# EAGLE design driver2 (EAGLE 9.5.2)
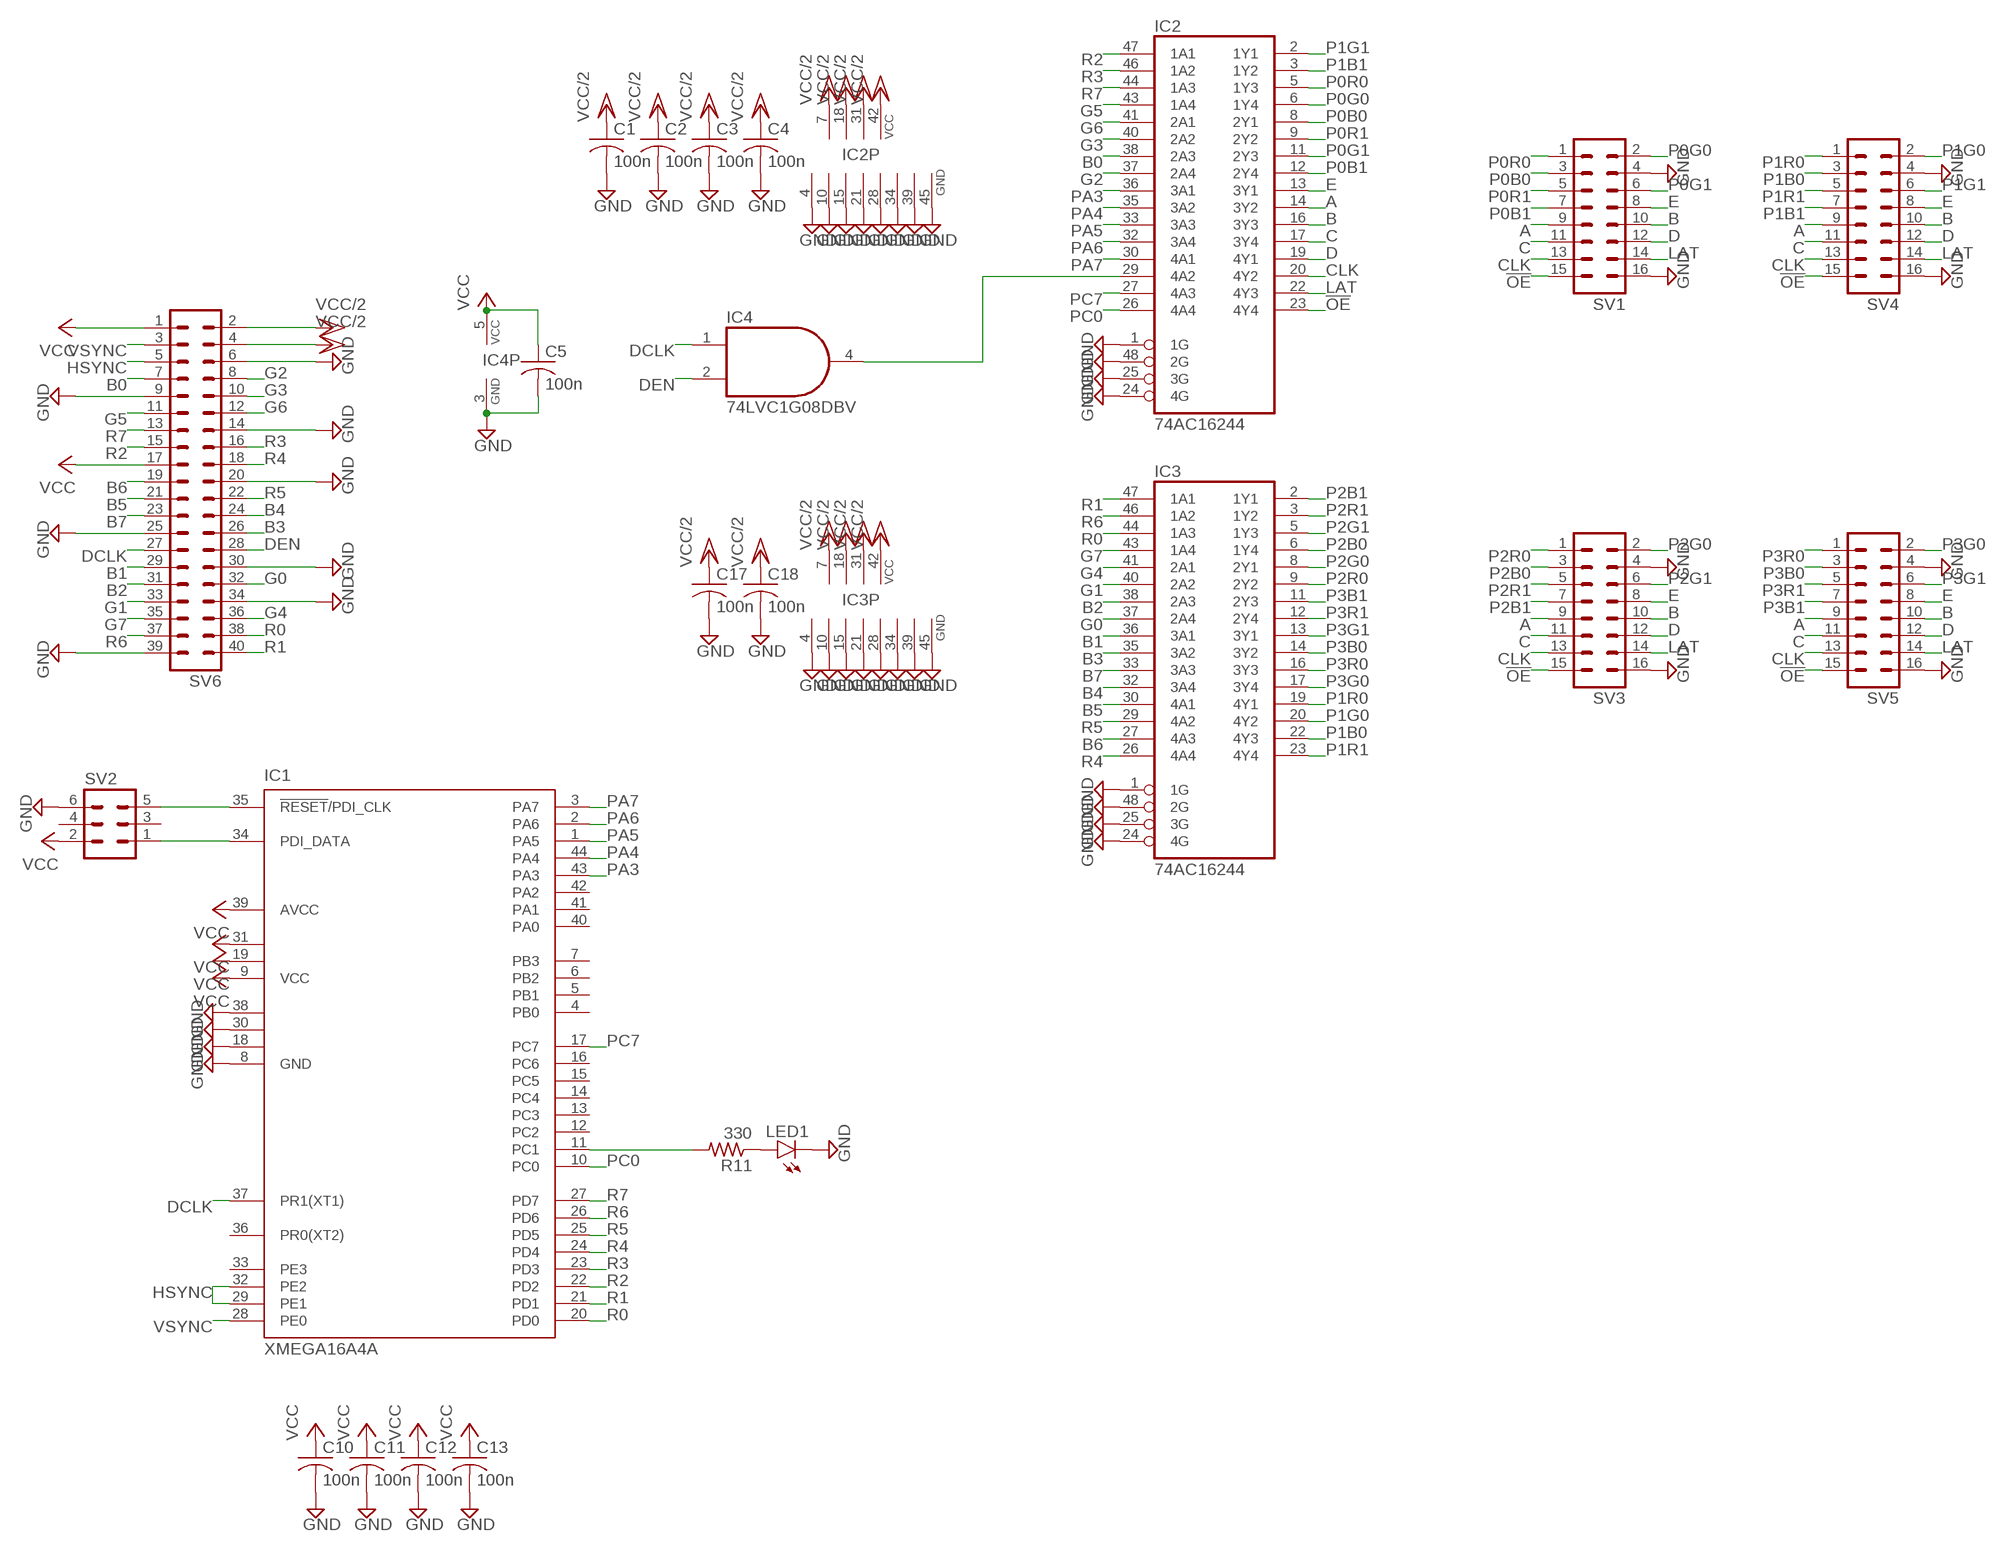
[diagram p0: schematic, sheet 1]

## Parts
C1  100n  C-USC0402  [C0402]
C2  100n  C-USC0402  [C0402]
C3  100n  C-USC0402  [C0402]
C4  100n  C-USC0402  [C0402]
C5  100n  C-USC0402  [C0402]
C10  100n  C-USC0402  [C0402]
C11  100n  C-USC0402  [C0402]
C12  100n  C-USC0402  [C0402]
C13  100n  C-USC0402  [C0402]
C17  100n  C-USC0402  [C0402]
C18  100n  C-USC0402  [C0402]
IC1  XMEGA16A4A  [TQFP44]
IC2  74AC16244  [SSOP48DL]
IC3  74AC16244  [SSOP48DL]
IC4  74LVC1G08DBV  [SOT23-5]
LED1  LEDCHIPLED_0805  [CHIPLED_0805]
R11  330  R-US_R0402  [R0402]
SV1  MA08-2  [MA08-2]
SV2  MA03-2  [MA03-2]
SV3  MA08-2  [MA08-2]
SV4  MA08-2  [MA08-2]
SV5  MA08-2  [MA08-2]
SV6  MA20-2  [MA20-2]

## Nets
!OE: IC2.23(4Y4) SV1.15 SV3.15 SV4.15 SV5.15
A: IC2.14(3Y2) SV1.9 SV3.9 SV4.9 SV5.9
B: IC2.16(3Y3) SV1.10 SV3.10 SV4.10 SV5.10
B0: IC2.38(2A3) SV6.7
B1: IC3.36(3A1) SV6.29
B2: IC3.38(2A3) SV6.31
B3: IC3.35(3A2) SV6.26
B4: IC3.32(3A4) SV6.24
B5: IC3.30(4A1) SV6.21
B6: IC3.27(4A3) SV6.19
B7: IC3.33(3A3) SV6.23
C: IC2.17(3Y4) SV1.11 SV3.11 SV4.11 SV5.11
CLK: IC2.20(4Y2) SV1.13 SV3.13 SV4.13 SV5.13
D: IC2.19(4Y1) SV1.12 SV3.12 SV4.12 SV5.12
DCLK: IC1.37(PR1(XT1)) IC4.1(I0) SV6.27
DEN: IC4.2(I1) SV6.28
E: IC2.13(3Y1) SV1.8 SV3.8 SV4.8 SV5.8
G0: IC3.37(2A4) SV6.32
G1: IC3.40(2A2) SV6.33
G2: IC2.37(2A4) SV6.8
G3: IC2.40(2A2) SV6.10
G4: IC3.41(2A1) SV6.36
G5: IC2.43(1A4) SV6.11
G6: IC2.41(2A1) SV6.12
G7: IC3.43(1A4) SV6.35
GND: C1.2 C2.2 C3.2 C4.2 C5.2 C10.2 C11.2 C12.2 C13.2 C17.2 C18.2 IC1.8(GND) IC1.18(GND1) IC1.30(GND2) IC1.38(GND3) IC2.1(1G) IC2.4(GND) IC2.10(GND) IC2.15(GND) IC2.21(GND) IC2.24(4G) IC2.25(3G) IC2.28(GND) IC2.34(GND) IC2.39(GND) IC2.45(GND) IC2.48(2G) IC3.1(1G) IC3.4(GND) IC3.10(GND) IC3.15(GND) IC3.21(GND) IC3.24(4G) IC3.25(3G) IC3.28(GND) IC3.34(GND) IC3.39(GND) IC3.45(GND) IC3.48(2G) IC4.3(GND) LED1.C SV1.4 SV1.16 SV2.6 SV3.4 SV3.16 SV4.4 SV4.16 SV5.4 SV5.16 SV6.6 SV6.9 SV6.14 SV6.20 SV6.25 SV6.30 SV6.34 SV6.39
HSYNC: IC1.29(PE1) IC1.32(PE2) SV6.5
LAT: IC2.22(4Y3) SV1.14 SV3.14 SV4.14 SV5.14
N$1: IC1.11(PC1) R11.2
N$16: IC2.29(4A2) IC4.4(O)
N$41: IC1.34(PDI_DATA) SV2.1
N$42: IC1.35(!RESET!/PDI_CLK) SV2.5
N$45: LED1.A R11.1
P0B0: IC2.8(2Y1) SV1.3
P0B1: IC2.12(2Y4) SV1.7
P0G0: IC2.6(1Y4) SV1.2
P0G1: IC2.11(2Y3) SV1.6
P0R0: IC2.5(1Y3) SV1.1
P0R1: IC2.9(2Y2) SV1.5
P1B0: IC3.22(4Y3) SV4.3
P1B1: IC2.3(1Y2) SV4.7
P1G0: IC3.20(4Y2) SV4.2
P1G1: IC2.2(1Y1) SV4.6
P1R0: IC3.19(4Y1) SV4.1
P1R1: IC3.23(4Y4) SV4.5
P2B0: IC3.6(1Y4) SV3.3
P2B1: IC3.2(1Y1) SV3.7
P2G0: IC3.8(2Y1) SV3.2
P2G1: IC3.5(1Y3) SV3.6
P2R0: IC3.9(2Y2) SV3.1
P2R1: IC3.3(1Y2) SV3.5
P3B0: IC3.14(3Y2) SV5.3
P3B1: IC3.11(2Y3) SV5.7
P3G0: IC3.17(3Y4) SV5.2
P3G1: IC3.13(3Y1) SV5.6
P3R0: IC3.16(3Y3) SV5.1
P3R1: IC3.12(2Y4) SV5.5
PA3: IC1.43(PA3) IC2.36(3A1)
PA4: IC1.44(PA4) IC2.35(3A2)
PA5: IC1.1(PA5) IC2.33(3A3)
PA6: IC1.2(PA6) IC2.32(3A4)
PA7: IC1.3(PA7) IC2.30(4A1)
PC0: IC1.10(PC0) IC2.26(4A4)
PC7: IC1.17(PC7) IC2.27(4A3)
R0: IC1.20(PD0) IC3.44(1A3) SV6.38
R1: IC1.21(PD1) IC3.47(1A1) SV6.40
R2: IC1.22(PD2) IC2.47(1A1) SV6.15
R3: IC1.23(PD3) IC2.46(1A2) SV6.16
R4: IC1.24(PD4) IC3.26(4A4) SV6.18
R5: IC1.25(PD5) IC3.29(4A2) SV6.22
R6: IC1.26(PD6) IC3.46(1A2) SV6.37
R7: IC1.27(PD7) IC2.44(1A3) SV6.13
VCC: C5.1 C10.1 C11.1 C12.1 C13.1 IC1.9(VCC) IC1.19(VCC1) IC1.31(VCC2) IC1.39(AVCC) IC4.5(VCC) SV2.2 SV6.1 SV6.17
VCC/2: C1.1 C2.1 C3.1 C4.1 C17.1 C18.1 IC2.7(VCC) IC2.18(VCC) IC2.31(VCC) IC2.42(VCC) IC3.7(VCC) IC3.18(VCC) IC3.31(VCC) IC3.42(VCC) SV6.2 SV6.4
VSYNC: IC1.28(PE0) SV6.3
Unconnected: IC1.4(PB0) IC1.5(PB1) IC1.6(PB2) IC1.7(PB3) IC1.12(PC2) IC1.13(PC3) IC1.14(PC4) IC1.15(PC5) IC1.16(PC6) IC1.33(PE3) IC1.36(PR0(XT2)) IC1.40(PA0) IC1.41(PA1) IC1.42(PA2) SV2.3 SV2.4

## Library data of the parts
C1-C5 C10-C13 C17 C18 = rcl:C-US: CAPACITOR, American symbol; SPICEPREFIX: C
IC1 = atmel:XMEGA16A4: MICROCONTROLLER Features High-performance, Low-power 8/16-bit AVR XMEGA Microcontroller Non-Volatile Program and Data Memories - 16 KB - 128 KB of In-System Self-Programmable Flash - 4 KB - 8 KB Boot Code Section with Independent Lock Bits - 1 KB - 2 KB EEPROM - 2 KB - 8 KB Internal SRAM Peripheral Features - Four-channel DMA Controller with support for external requests - Eight-channel Event System - Five 16-bit Timer/Counters Three Timer/Counters with 4 Output Compare or Input Capture channels Two Timer/Counters with 2 Output Compare or Input Capture channels High-Resolution Extensions on all Timer/Counters Advanced Waveform Extension on one Timer/Counter - Five USARTs IrDA Extension on one USART - Two Two-Wire Interfaces with dual address match (I2C and SMBus compatible) - Two SPIs (Serial Peripheral Interfaces) peripherals - AES and DES Crypto Engine - 16-bit Real Time Counter with Separate Oscillator - One Twelve-channel, 12-bit, 2 Msps Analog to Digital Converter - One Two-channel, 12-bit, 1 Msps Digital to Analog Converter - Two Analog Comparators with Window compare function - External Interrupts on all General Purpose I/O pins - Programmable Watchdog Timer with Separate On-chip Ultra Low Power Oscillator Special Microcontroller Features - Power-on Reset and Programmable Brown-out Detection - Internal and External Clock Options with PLL - Programmable Multi-level Interrupt Controller - Sleep Modes: Idle, Power-down, Standby, Power-save, Extended Standby - Advanced Programming, Test and Debugging Interfaces PDI (Program and Debug Interface) for programming, test and debugging I/O and Packages - 34 Programmable I/O Lines - 44 - lead TQFP - 44 - pad VQFN/QFN - 49 - ball VFBGA Operating Voltage - 1.6 - 3.6V Speed performance - 0 - 12 MHz @ 1.6 - 3.6V - 0 - 32 MHz @ 2.7 - 3.6V Drawn by Dipl.-Ing. (FH) Robert Siegler Created: 27.05.09; OC_FARNELL: unknown; OC_NEWARK: unknown
IC2 IC3 = 74ac-logic:74AC16244: 16-bit BUFFER/LINE DRIVER, 3-state
IC4 = 74xx-little-us:74*1G08: 2-input AND gate
LED1 = led:LED: LED OSRAM: - CHIPLED LG R971, LG N971, LY N971, LG Q971, LY Q971, LO R971, LY R971 LH N974, LH R974 LS Q976, LO Q976, LY Q976 LO Q996 - Hyper CHIPLED LW Q18S LB Q993, LB Q99A, LB R99A - SideLED LS A670, LO A670, LY A670, LG A670, LP A670 LB A673, LV A673, LT A673, LW A673 LH A674 LY A675 LS A676, LA A676, LO A676, LY A676, LW A676 LS A679, LY A679, LG A679 - Hyper Micro SIDELED® LS Y876, LA Y876, LO Y876, LY Y876 LT Y87S - SmartLED LW L88C, LW L88S LB L89C, LB L89S, LG L890 LS L89K, LO L89K, LY L89K LS L896, LA L896, LO L896, LY L896 - TOPLED LS T670, LO T670, LY T670, LG T670, LP T670 LSG T670, LSP T670, LSY T670, LOP T670, LYG T670 LG T671, LOG T671, LSG T671 LB T673, LV T673, LT T673, LW T673 LH T674 LS T676, LA T676, LO T676, LY T676, LB T676, LH T676, LSB T676, LW T676 LB T67C, LV T67C, LT T67C, LS T67K, LO T67K, LY T67K, LW E67C LS E67B, LA E67B, LO E67B, LY E67B, LB E67C, LV E67C, LT E67C LW T67C LS T679, LY T679, LG T679 LS T770, LO T770, LY T770, LG T770, LP T770 LB T773, LV T773, LT T773, LW T773 LH T774 LS E675, LA E675, LY E675, LS T675 LS T776, LA T776, LO T776, LY T776, LB T776 LHGB T686 LT T68C, LB T68C - Hyper Mini TOPLED® LB M676 - Mini TOPLED Santana® LG M470 LS M47K, LO M47K, LY M47K Source: http://www.osram.convergy.de LUXEON: - LUMILED® LXK2-PW12-R00, LXK2-PW12-S00, LXK2-PW14-U00, LXK2-PW14-V00 LXK2-PM12-R00, LXK2-PM12-S00, LXK2-PM14-U00 LXK2-PE12-Q00, LXK2-PE12-R00, LXK2-PE12-S00, LXK2-PE14-T00, LXK2-PE14-U00 LXK2-PB12-K00, LXK2-PB12-L00, LXK2-PB12-M00, LXK2-PB14-N00, LXK2-PB14-P00, LXK2-PB14-Q00 LXK2-PR12-L00, LXK2-PR12-M00, LXK2-PR14-Q00, LXK2-PR14-R00 LXK2-PD12-Q00, LXK2-PD12-R00, LXK2-PD12-S00 LXK2-PH12-R00, LXK2-PH12-S00 LXK2-PL12-P00, LXK2-PL12-Q00, LXK2-PL12-R00 Source: www.luxeon.com KINGBRIGHT: KA-3528ASYC Source: www.kingbright.com
R11 = rcl:R-US_: RESISTOR, American symbol; SPICEPREFIX: R
SV1 SV3-SV5 = con-lstb:MA08-2: PIN HEADER; OC_FARNELL: unknown; OC_NEWARK: unknown
SV2 = con-lstb:MA03-2: PIN HEADER; OC_FARNELL: unknown; OC_NEWARK: unknown
SV6 = con-lstb:MA20-2: PIN HEADER; OC_FARNELL: unknown; OC_NEWARK: unknown

## Board
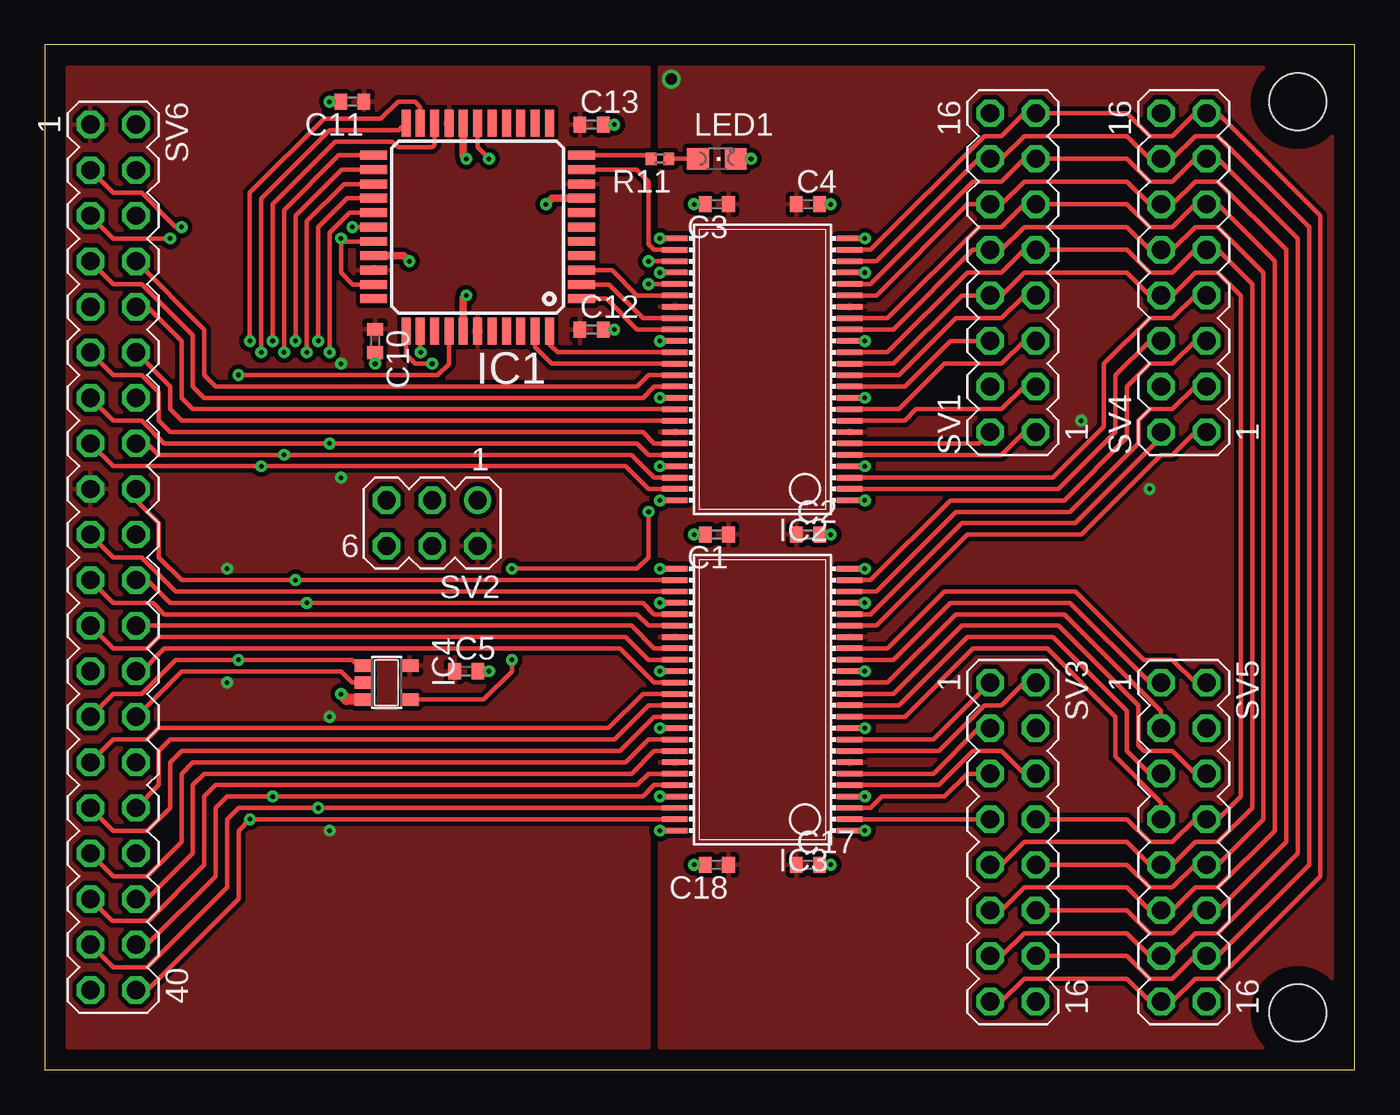
[diagram p1: board, top side]
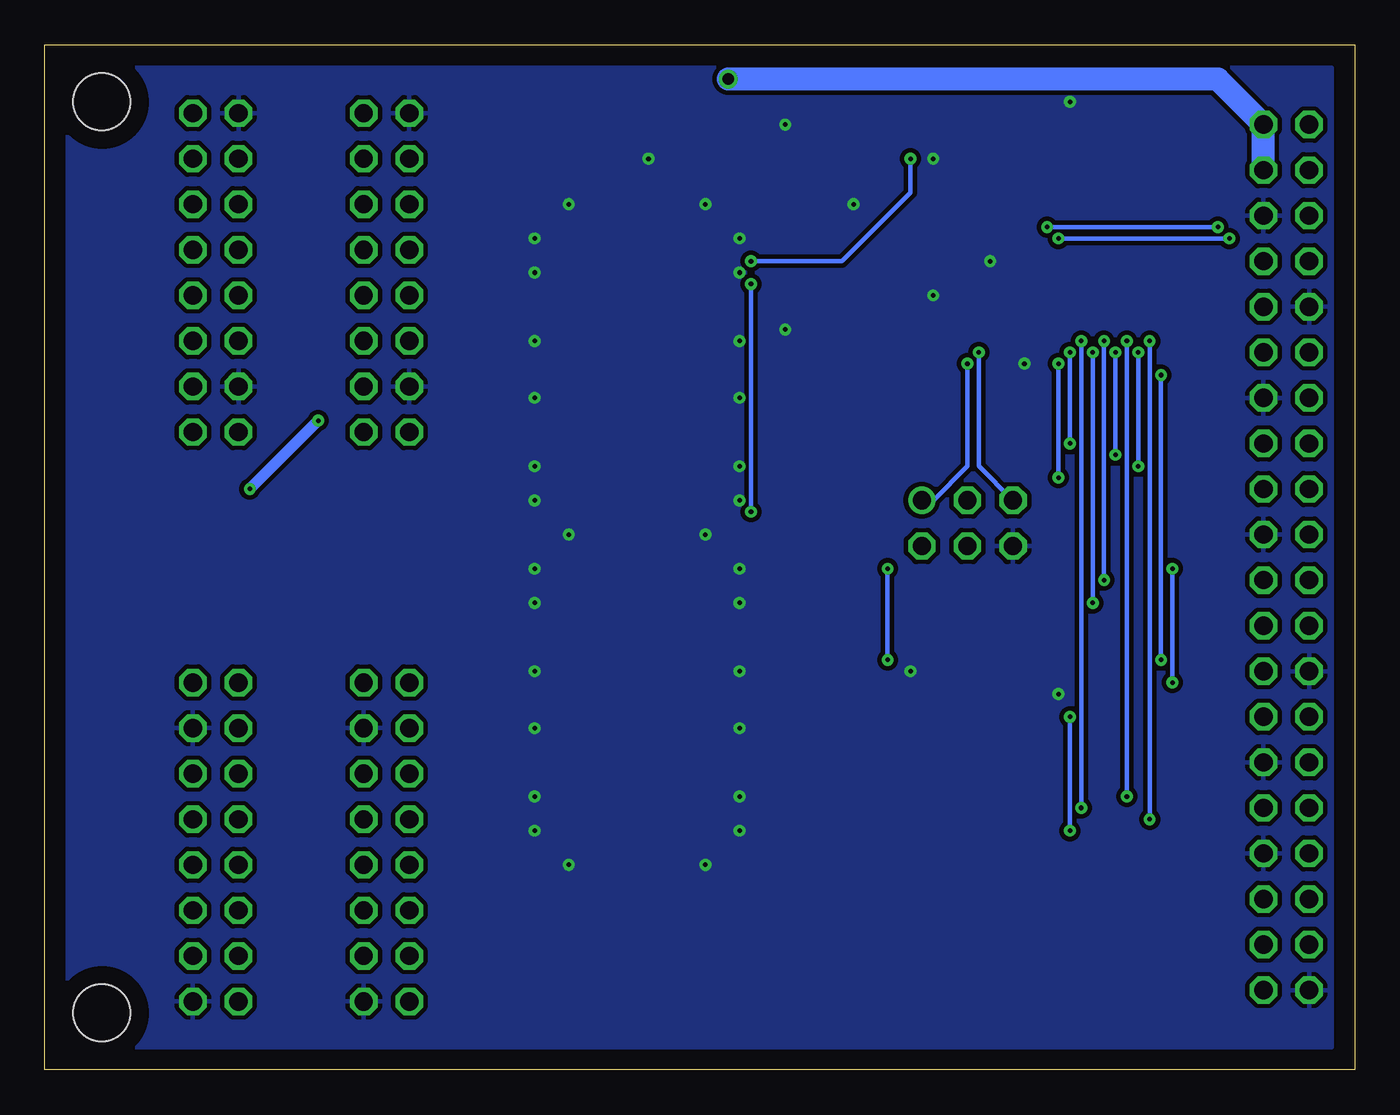
[diagram p2: board, bottom side, seen from below]

Size 73.03 x 57.15 mm. Coordinates in mm from the lower left corner, seen from the top.
Outline: 0,57.15 0,0 73.03,0 73.03,57.15 0,57.15
Copper layers (1*16): Top 0.035mm / dielectric 0.5mm / Bottom 0.035mm
Design rules "33each": minimum track width 5mil, minimum drill 10mil, track to track 5mil, track to pad 5mil, pad to pad 5mil, via to via 5mil, smd to smd 5mil, copper to edge 40mil, drill to drill 8mil, minimum pad ring 10mil, minimum via ring 8mil, stop-mask expansion 4mil, vias tented up to drill 0mil, thermal gap 10mil
Holes 3.17 mm at 69.85,53.98 69.85,3.17

### Footprints (pad centres in the part's own frame; a part is rotated, then mirrored left to right if it is on the bottom)
C0402 = smd 0.7 x 0.9: 1 -0.65,0; 2 0.65,0
TQFP44 = smd 1.5 x 0.5: 1 -5.8,4; 2 -5.8,3.2; 3 -5.8,2.4; 4 -5.8,1.6; 5 -5.8,0.8; 6 -5.8,0; 7 -5.8,-0.8; 8 -5.8,-1.6; 9 -5.8,-2.4; 10 -5.8,-3.2; 11 -5.8,-4; 23 5.8,-4; 24 5.8,-3.2; 25 5.8,-2.4; 26 5.8,-1.6; 27 5.8,-0.8; 28 5.8,0; 29 5.8,0.8; 30 5.8,1.6; 31 5.8,2.4; 32 5.8,3.2; 33 5.8,4 | smd 0.5 x 1.5: 12 -4,-5.8; 13 -3.2,-5.8; 14 -2.4,-5.8; 15 -1.6,-5.8; 16 -0.8,-5.8; 17 0,-5.8; 18 0.8,-5.8; 19 1.6,-5.8; 20 2.4,-5.8; 21 3.2,-5.8; 22 4,-5.8; 34 4,5.8; 35 3.2,5.8; 36 2.4,5.8; 37 1.6,5.8; 38 0.8,5.8; 39 0,5.8; 40 -0.8,5.8; 41 -1.6,5.8; 42 -2.4,5.8; 43 -3.2,5.8; 44 -4,5.8
SSOP48DL = smd 0.305 x 1.422: 1 -6.985,-4.877; 2 -6.35,-4.877; 3 -5.715,-4.877; 4 -5.08,-4.877; 5 -4.445,-4.877; 6 -3.81,-4.877; 7 -3.175,-4.877; 8 -2.54,-4.877; 9 -1.905,-4.877; 10 -1.27,-4.877; 11 -0.635,-4.877; 12 0,-4.877; 13 0.635,-4.877; 14 1.27,-4.877; 15 1.905,-4.877; 16 2.54,-4.877; 17 3.175,-4.877; 18 3.81,-4.877; 19 4.445,-4.877; 20 5.08,-4.877; 21 5.715,-4.877; 22 6.35,-4.877; 23 6.985,-4.877; 24 7.62,-4.877; 25 7.62,4.877; 26 6.985,4.877; 27 6.35,4.877; 28 5.715,4.877; 29 5.08,4.877; 30 4.445,4.877; 31 3.81,4.877; 32 3.175,4.877; 33 2.54,4.877; 34 1.905,4.877; 35 1.27,4.877; 36 0.635,4.877; 37 0,4.877; 38 -0.635,4.877; 39 -1.27,4.877; 40 -1.905,4.877; 41 -2.54,4.877; 42 -3.175,4.877; 43 -3.81,4.877; 44 -4.445,4.877; 45 -5.08,4.877; 46 -5.715,4.877; 47 -6.35,4.877; 48 -6.985,4.877
SOT23-5 = smd 0.69 x 0.99: 1 -0.95,-1.29; 2 0,-1.29; 3 0.95,-1.29; 4 0.95,1.3; 5 -0.95,1.3
CHIPLED_0805 = smd 1.2 x 1.2: A 0,-1.05; C 0,1.05
R0402 = smd 0.6 x 0.7: 1 -0.5,0; 2 0.5,0
MA08-2 = drill 1.016 octagon: 1 -8.89,-1.27; 2 -8.89,1.27; 3 -6.35,-1.27; 4 -6.35,1.27; 5 -3.81,-1.27; 6 -3.81,1.27; 7 -1.27,-1.27; 8 -1.27,1.27; 9 1.27,-1.27; 10 1.27,1.27; 11 3.81,-1.27; 12 3.81,1.27; 13 6.35,-1.27; 14 6.35,1.27; 15 8.89,-1.27; 16 8.89,1.27
MA03-2 = drill 1.016: 1 -2.54,-1.27 | drill 1.016 octagon: 2 -2.54,1.27; 3 0,-1.27; 4 0,1.27; 5 2.54,-1.27; 6 2.54,1.27
MA20-2 = drill 1.016 octagon: 1 -24.13,-1.27; 2 -24.13,1.27; 3 -21.59,-1.27; 4 -21.59,1.27; 5 -19.05,-1.27; 6 -19.05,1.27; 7 -16.51,-1.27; 8 -16.51,1.27; 9 -13.97,-1.27; 10 -13.97,1.27; 11 -11.43,-1.27; 12 -11.43,1.27; 13 -8.89,-1.27; 14 -8.89,1.27; 15 -6.35,-1.27; 16 -6.35,1.27; 17 -3.81,-1.27; 18 -3.81,1.27; 19 -1.27,-1.27; 20 -1.27,1.27; 21 1.27,-1.27; 22 1.27,1.27; 23 3.81,-1.27; 24 3.81,1.27; 25 6.35,-1.27; 26 6.35,1.27; 27 8.89,-1.27; 28 8.89,1.27; 29 11.43,-1.27; 30 11.43,1.27; 31 13.97,-1.27; 32 13.97,1.27; 33 16.51,-1.27; 34 16.51,1.27; 35 19.05,-1.27; 36 19.05,1.27; 37 21.59,-1.27; 38 21.59,1.27; 39 24.13,-1.27; 40 24.13,1.27

### Placement (x,y rotation side)
C1  37.47,29.84 180 top
C2  42.55,29.84 0 top
C3  37.47,48.26 180 top
C4  42.55,48.26 0 top
C5  23.5,22.23 0 top
C10  18.41,40.64 270 top
C11  17.14,53.98 180 top
C12  30.48,41.27 0 top
C13  30.48,52.7 0 top
C17  42.55,11.43 0 top
C18  37.47,11.43 180 top
IC1  24.13,46.99 180 top
IC2  40.01,38.73 90 top
IC3  40.01,20.32 90 top
IC4  19.05,21.59 270 top
LED1  37.47,50.8 270 top
R11  34.29,50.8 180 top
SV1  53.98,44.45 90 top
SV2  21.59,30.48 180 top
SV3  53.98,12.7 270 top
SV4  63.5,44.45 90 top
SV5  63.5,12.7 270 top
SV6  3.81,28.57 270 top

### Tracks (layer width: path | path; a pad name or v marks a point on that pad's centre or on a via)
!OE
  Top 0.254: SV3.15 53.34,3.81 54.61,5.08 60.33,5.08 61.59,3.81 SV5.15 62.87,3.81 64.14,5.08 65.41,5.08 71.12,10.79 71.12,47.62 65.41,53.34 SV4.15 64.14,53.34 62.87,52.07 61.59,52.07 60.33,53.34 SV1.15 54.61,53.34 53.34,52.07 52.39,52.07 46.04,45.72 IC2.23
A
  Top 0.254: IC2.14 46.99,40.01 51.44,44.45 53.34,44.45 54.61,45.72 SV1.9 60.33,45.72 61.59,44.45 62.87,44.45 64.14,45.72 SV4.9 65.41,45.72 67.31,43.81 67.31,14.61 65.41,12.7 64.14,12.7 62.87,11.43 SV5.9 61.59,11.43 60.33,12.7 54.61,12.7 53.34,11.43 SV3.9
B
  Top 0.254: IC2.16 47.31,41.27 51.75,45.72 SV1.10 53.34,45.72 54.61,46.99 60.33,46.99 61.59,45.72 SV4.10 62.87,45.72 64.14,46.99 65.41,46.99 67.94,44.45 67.94,13.97 65.41,11.43 SV5.10 64.14,11.43 62.87,10.16 61.59,10.16 60.33,11.43 SV3.10
B0
  Top 0.254: SV6.7 3.81,43.81 5.4,43.81 8.26,40.96 8.26,38.1 8.89,37.47 33.34,37.47 33.97,38.1 IC2.38
B1
  Top 0.254: IC3.36 33.34,20.95 31.43,19.05 6.35,19.05 5.71,18.41 3.81,18.41 SV6.29
B2
  Top 0.254: SV6.31 3.81,13.34 5.71,13.34 6.99,14.61 6.99,17.14 7.62,17.78 32.07,17.78 33.97,19.68 IC3.38
B3
  Top 0.254: IC3.35 33.97,21.59 32.07,23.5 6.67,23.5 5.4,22.23 SV6.26
B4
  Top 0.254: IC3.32 33.97,23.5 32.7,24.77 SV6.24
B5
  Top 0.254: SV6.21 3.81,26.04 6.03,26.04 6.67,25.4 33.02,25.4 33.66,24.77 IC3.30
B6
  Top 0.254: SV6.19 3.81,28.57 5.4,28.57 7.3,26.67 IC3.27
B7
  Top 0.254: SV6.23 3.81,23.5 5.71,23.5 6.35,24.13 32.38,24.13 33.66,22.86 IC3.33
C
  Top 0.254: IC2.17 46.99,41.91 52.07,46.99 53.34,46.99 54.61,48.26 SV1.11 60.33,48.26 61.59,46.99 62.87,46.99 64.14,48.26 SV4.11 65.41,48.26 68.58,45.09 68.58,13.34 65.41,10.16 64.14,10.16 62.87,8.89 SV5.11 61.59,8.89 60.33,10.16 54.61,10.16 53.34,8.89 SV3.11
CLK
  Top 0.254: IC2.20 46.04,43.81 51.75,49.53 53.34,49.53 54.61,50.8 SV1.13 60.33,50.8 61.59,49.53 62.87,49.53 64.14,50.8 SV4.13 65.41,50.8 69.85,46.35 69.85,12.06 65.41,7.62 64.14,7.62 62.87,6.35 SV5.13 61.59,6.35 60.33,7.62 54.61,7.62 53.34,6.35 SV3.13
D
  Top 0.254: IC2.19 46.35,43.18 51.44,48.26 SV1.12 53.34,48.26 54.61,49.53 60.33,49.53 61.59,48.26 SV4.12 62.87,48.26 64.14,49.53 65.41,49.53 69.22,45.72 69.22,12.7 65.41,8.89 SV5.12 64.14,8.89 62.87,7.62 61.59,7.62 60.33,8.89 SV3.12
DCLK  (via drill 0.25)
  Top 0.254: SV6.27 3.81,20.95 5.4,20.95 7.3,22.86 v10.79,22.86 17.14,22.86 17.46,22.54 IC4.1 | v10.79,38.73 21.91,38.73 22.53,39.36 IC1.37
  Bottom 0.254: v10.79,38.73 v10.79,22.86
DEN
  Top 0.254: IC4.2 17.14,21.59 16.51,22.23 7.62,22.23 SV6.28
E
  Top 0.254: IC2.13 47.31,39.37 51.12,43.18 SV1.8 53.34,43.18 54.61,44.45 60.33,44.45 61.59,43.18 SV4.8 62.87,43.18 64.14,44.45 65.41,44.45 66.67,43.18 66.67,15.24 65.41,13.97 SV5.8 64.14,13.97 62.87,12.7 61.59,12.7 60.33,13.97 SV3.8
G0
  Top 0.254: 5.4,14.61 SV6.32 6.35,15.88 6.35,17.78 6.99,18.41 31.75,18.41 33.66,20.32 IC3.37
G1
  Top 0.254: SV6.33 3.81,10.79 5.71,10.79 7.62,12.7 7.62,16.51 8.26,17.14 32.38,17.14 33.66,18.41 IC3.40
G2
  Top 0.254: IC2.37 33.66,38.73 33.02,38.1 9.53,38.1 8.89,38.73 8.89,41.27 SV6.8
G3
  Top 0.254: SV6.10 5.71,42.55 7.62,40.64 7.62,37.47 8.26,36.83 IC2.40
G4
  Top 0.254: IC3.41 33.97,17.78 32.7,16.51 8.89,16.51 8.26,15.88 8.26,12.06 5.71,9.53 SV6.36
G5
  Top 0.254: SV6.11 3.81,38.73 5.4,38.73 6.35,37.78 6.35,36.2 6.99,35.56 33.34,35.56 33.97,34.92 IC2.43
G6
  Top 0.254: SV6.12 6.99,38.1 6.99,36.83 7.62,36.2 IC2.41
G7
  Top 0.254: SV6.35 3.75,8.32 5.78,8.32 8.89,11.43 8.89,15.24 9.53,15.88 33.02,15.88 33.66,16.51 IC3.43
GND  (via drill 0.25)
  Top 0.254: IC2.1 v45.72,31.75 | IC2.10 v45.72,37.47 | IC2.48 v34.29,31.75 | IC2.39 v34.29,37.47 | IC2.34 v34.29,40.64 | IC2.28 v34.29,44.45 | IC2.15 v45.72,40.64 | IC2.21 v45.72,44.45 | IC3.1 v45.72,13.34 | IC3.4 v45.72,15.24 | IC3.10 v45.72,19.05 | IC3.21 v45.72,26.04 | IC3.24 v45.72,27.94 | IC3.15 v45.72,22.23 | IC3.48 v34.29,13.34 | IC3.45 v34.29,15.24 | IC3.39 v34.29,19.05 | IC3.34 v34.29,22.23 | IC3.28 v34.29,26.04 | IC2.25 v34.29,46.35 | IC3.25 v34.29,27.94 | IC2.45 v34.29,33.66 | IC2.4 v45.72,33.66 | IC2.24 v45.72,46.35
  Top 0.406: C2.2 v43.81,29.84 | C1.2 v36.2,29.84 | C4.2 v43.81,48.26 | C3.2 v36.2,48.26 | C17.2 v43.81,11.43 | C18.2 v36.2,11.43 | IC1.30 20.02,45.39 v20.32,45.09 | IC1.38 23.33,43.02 v23.5,43.18 | IC1.8 28.27,48.59 v27.94,48.26 | IC1.18 23.33,50.97 v23.5,50.8
  Top 0.61: C12.2 v31.75,41.27 | C10.2 v18.41,39.37 | C13.2 v31.75,52.7 | v39.37,50.8 LED1.C | C11.2 v15.88,53.98 | C5.2 v24.77,22.23 | IC4.3 16.82,20.64 v16.51,20.95
  pour Bottom (isolate 0.254): 1.27,55.88 71.75,55.88 71.75,1.27 1.27,1.27
HSYNC  (via drill 0.25)
  Top 0.254: v6.99,46.35 3.81,46.35 SV6.5 | IC1.32 17.17,43.79 16.51,44.45 v16.51,46.35 16.68,46.19 IC1.29
  Bottom 0.254: v6.99,46.35 v16.51,46.35
LAT
  Top 0.254: IC2.22 46.35,45.09 52.07,50.8 SV1.14 53.34,50.8 54.61,52.07 60.33,52.07 61.59,50.8 SV4.14 62.87,50.8 64.14,52.07 65.41,52.07 70.48,46.99 70.48,11.43 65.41,6.35 SV5.14 64.14,6.35 62.87,5.08 61.59,5.08 60.33,6.35 SV3.14
N$1
  Top 0.254: R11.2 33.6,50.99 IC1.11
N$16  (via drill 0.25)
  Top 0.254: v33.66,43.81 IC2.29 | IC4.4 24.45,20.64 26.04,22.23 v26.04,22.86 | v33.66,31.11 33.66,28.57 33.02,27.94 v26.04,27.94
  Bottom 0.254: v33.66,43.81 v33.66,31.11 | v26.04,22.86 v26.04,27.94
N$41  (via drill 0.25)
  Top 0.254: v21.59,39.37 20.64,39.37 20.13,39.88 IC1.34
  Bottom 0.254: v21.59,39.37 21.59,33.66 23.5,31.75 SV2.1
N$42  (via drill 0.25)
  Top 0.254: IC1.35 20.93,40.03 v20.95,40.01
  Bottom 0.254: v20.95,40.01 20.95,33.66 SV2.5
N$45
  Top 0.254: LED1.A R11.1
P0B0
  Top 0.254: SV1.3 54.61,38.1 53.34,36.83 48.58,36.83 47.94,36.2 IC2.8
P0B1
  Top 0.254: IC2.12 47.62,38.73 50.8,41.91 53.34,41.91 54.61,43.18 SV1.7
P0G0
  Top 0.254: IC2.6 52.07,34.92 SV1.2
P0G1
  Top 0.254: IC2.11 47.94,38.1 50.48,40.64 SV1.6
P0R0
  Top 0.254: IC2.5 53.34,34.29 54.61,35.56 SV1.1
P0R1
  Top 0.254: IC2.9 47.62,36.83 50.16,39.37 53.34,39.37 54.61,40.64 SV1.5
P1B0
  Top 0.254: IC3.22 46.35,26.67 50.8,31.11 57.15,31.11 60.96,34.92 60.96,36.2 61.59,36.83 62.87,36.83 64.14,38.1 SV4.3
P1B1
  Top 0.254: SV4.7 64.14,43.18 62.87,41.91 61.59,41.91 59.05,39.37 59.05,35.88 56.2,33.02 IC2.3
P1G0
  Top 0.254: IC3.20 46.04,25.4 51.12,30.48 57.47,30.48 62.23,35.24 SV4.2
P1G1
  Top 0.254: SV4.6 61.59,40.64 59.69,38.73 59.69,35.56 56.52,32.38 IC2.2
P1R0
  Top 0.254: IC3.19 46.35,24.77 51.44,29.84 57.78,29.84 62.23,34.29 62.87,34.29 64.14,35.56 SV4.1
P1R1
  Top 0.254: IC3.23 46.04,27.3 50.48,31.75 56.83,31.75 60.33,35.24 60.33,38.1 61.59,39.37 62.87,39.37 64.14,40.64 SV4.5
P2B0
  Top 0.254: SV3.3 52.07,19.05 49.53,16.51 IC3.6
P2B1
  Top 0.254: IC3.2 SV3.7
P2G0
  Top 0.254: SV3.2 54.61,21.59 53.34,20.32 52.39,20.32 49.85,17.78 IC3.8
P2G1
  Top 0.254: IC3.5 49.85,15.88 51.75,17.78 53.34,17.78 54.61,16.51 SV3.6
P2R0
  Top 0.254: IC3.9 49.53,18.41 SV3.1
P2R1
  Top 0.254: SV3.5 51.44,16.51 50.16,15.24 46.67,15.24 46.04,14.61 IC3.3
P3B0
  Top 0.254: IC3.14 46.99,21.59 50.8,25.4 56.83,25.4 62.23,20 SV5.3
P3B1
  Top 0.254: IC3.11 47.94,19.68 51.75,23.5 55.88,23.5 59.69,19.68 59.69,17.46 62.23,14.92 SV5.7
P3G0
  Top 0.254: IC3.17 46.99,23.5 50.16,26.67 57.47,26.67 61.28,22.86 62.87,22.86 64.14,21.59 SV5.2
P3G1
  Top 0.254: IC3.13 47.31,20.95 51.12,24.77 56.52,24.77 60.96,20.32 60.96,18.1 61.28,17.78 62.87,17.78 64.14,16.51 SV5.6
P3R0
  Top 0.254: IC3.16 47.31,22.86 50.48,26.04 57.15,26.04 61.59,21.59 SV5.1
P3R1
  Top 0.254: IC3.12 47.62,20.32 51.44,24.13 56.2,24.13 60.33,20 60.33,17.78 61.59,16.51 SV5.5
PA3
  Top 0.254: IC2.36 28.26,39.37 27.33,40.3 IC1.43
PA4
  Top 0.254: IC2.35 28.57,40.01 28.13,40.45 IC1.44
PA5
  Top 0.254: IC2.33 33.02,41.27 31.3,42.99 IC1.1
PA6
  Top 0.254: IC2.32 33.34,41.91 31.46,43.79 IC1.2
PA7
  Top 0.254: IC2.30 33.02,43.18 31.61,44.59 IC1.3
PC0
  Top 0.254: IC1.10 32.99,50.19 33.66,49.53 33.66,46.04 33.97,45.72 IC2.26
PC7  (via drill 0.25)
  Top 0.254: IC1.17 24.13,51.44 v24.77,50.8 | v33.66,45.09 IC2.27
  Bottom 0.254: v24.77,50.8 24.77,48.9 28.57,45.09 v33.66,45.09
R0  (via drill 0.25)
  Top 0.254: IC3.44 33.97,15.88 33.34,15.24 v12.7,15.24 10.16,15.24 9.53,14.61 9.53,10.79 5.71,6.99 SV6.38 | IC1.20 21.73,51.58 21.59,51.44 19.68,51.44 19.37,51.75 16.19,51.75 12.7,48.26 v12.7,40.64
  Bottom 0.254: v12.7,40.64 v12.7,15.24
R1  (via drill 0.25)
  Top 0.254: IC3.47 v11.43,13.97 10.79,13.34 10.79,9.53 5.71,4.45 SV6.40 | IC1.21 20.93,53.68 20.64,53.98 19.68,53.98 18.73,53.02 15.56,53.02 11.43,48.9 v11.43,40.64
  Bottom 0.254: v11.43,40.64 v11.43,13.97
R2  (via drill 0.25)
  Top 0.254: SV6.15 3.81,33.66 v12.06,33.66 32.38,33.66 33.66,32.38 IC2.47 | IC1.22 19.73,52.39 15.88,52.39 12.06,48.58 v12.06,40.01
  Bottom 0.254: v12.06,40.01 v12.06,33.66
R3  (via drill 0.25)
  Top 0.254: SV6.16 5.71,34.92 6.35,34.29 v13.34,34.29 32.7,34.29 33.97,33.02 IC2.46 | IC1.23 16.38,50.99 13.34,47.94 v13.34,40.01
  Bottom 0.254: v13.34,40.01 v13.34,34.29
R4  (via drill 0.25)
  Top 0.254: IC1.24 16.54,50.19 13.97,47.62 v13.97,40.64 | SV6.18 5.08,31.75 6.35,30.48 6.35,28.57 7.62,27.3 v13.97,27.3 IC3.26
  Bottom 0.254: v13.97,40.64 v13.97,27.3
R5  (via drill 0.25)
  Top 0.254: SV6.22 5.71,27.3 6.99,26.04 v14.61,26.04 33.34,26.04 33.97,25.4 IC3.29 | IC1.25 16.69,49.39 14.61,47.31 v14.61,40.01
  Bottom 0.254: v14.61,40.01 v14.61,26.04
R6  (via drill 0.25)
  Top 0.254: SV6.37 3.81,5.71 5.71,5.71 10.16,10.16 10.16,13.97 10.79,14.61 v15.24,14.61 IC3.46 | IC1.26 16.84,48.59 15.24,46.99 v15.24,40.64
  Bottom 0.254: v15.24,40.64 v15.24,14.61
R7  (via drill 0.25)
  Top 0.254: SV6.13 3.81,36.2 5.4,36.2 6.67,34.92 v15.88,34.92 33.02,34.92 33.66,34.29 IC2.44 | IC1.27 16.99,47.79 15.88,46.67 v15.88,40.01
  Bottom 0.254: v15.88,40.01 v15.88,34.92
VCC  (via drill 0.25)
  Bottom 0.254: v10.16,27.94 v10.16,21.59 | v15.88,19.68 v15.88,13.34 | v16.51,39.37 v16.51,33.02
  pour Top (isolate 0.254): 1.27,55.88 1.27,1.27 33.66,1.27 33.66,55.88
VCC/2  (via drill 0.25, 0.65)
  Bottom 0.61: v57.78,36.2 v61.59,32.38
  Bottom 1.27: SV6.4 SV6.2 7.62,55.24 v34.92,55.24
  pour Top (isolate 0.254): 34.29,55.88 34.29,1.27 71.75,1.27 71.75,55.88
VSYNC  (via drill 0.25)
  Top 0.254: v7.62,46.99 7.3,46.99 5.4,48.9 3.81,48.9 SV6.3 | IC1.28 v17.14,46.99
  Bottom 0.254: v7.62,46.99 v17.14,46.99